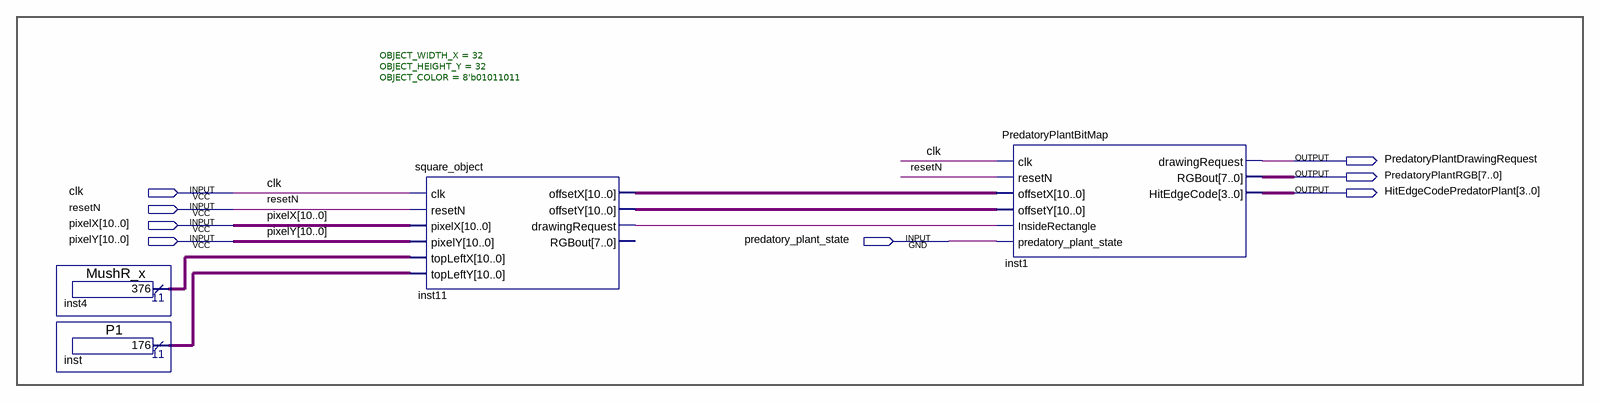
[diagram p0: schematic sheet]
// Quartus schematic PredatoryPlant_Display.bdf as structural Verilog: 4 symbols, 8 pins
module PredatoryPlant_Display (
  input  clk,
  input  resetN,
  input  [10:0] pixelX,
  input  [10:0] pixelY,
  input  predatory_plant_state,
  output PredatoryPlantDrawingRequest,
  output [7:0] PredatoryPlantRGB,
  output [3:0] HitEdgeCodePredatorPlant
);

  wire inst11_drawingrequest;
  wire [10:0] inst4_result, inst11_offsetx, inst11_offsety, inst_result;

  MushR_x inst4 (.result(inst4_result));
  P1 inst (.result(inst_result));
  square_object #(.OBJECT_WIDTH_X(32), .OBJECT_HEIGHT_Y(32), .OBJECT_COLOR(8'b01011011)) inst11 (
    .clk(clk), .resetN(resetN), .pixelX(pixelX), .pixelY(pixelY), .topLeftX(inst4_result),
    .topLeftY(inst_result), .offsetX(inst11_offsetx), .offsetY(inst11_offsety),
    .drawingRequest(inst11_drawingrequest));  // open: RGBout
  PredatoryPlantBitMap inst1 (
    .clk(clk), .resetN(resetN), .offsetX(inst11_offsetx), .offsetY(inst11_offsety),
    .InsideRectangle(inst11_drawingrequest), .predatory_plant_state(predatory_plant_state),
    .drawingRequest(PredatoryPlantDrawingRequest), .RGBout(PredatoryPlantRGB),
    .HitEdgeCode(HitEdgeCodePredatorPlant));
endmodule
